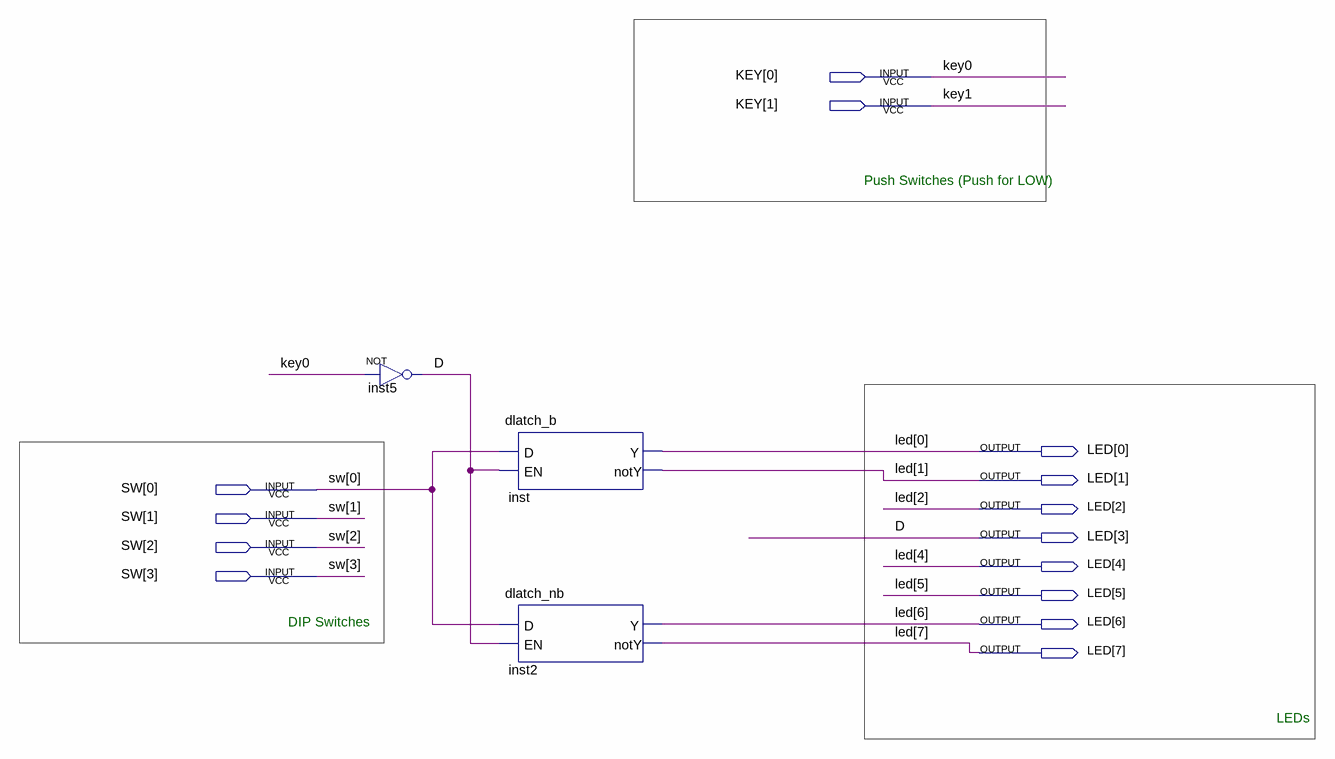
[diagram p0: schematic sheet]
// Quartus schematic TopLevelSchematic.bdf as structural Verilog: 3 symbols, 14 pins
module TopLevelSchematic (
  input  [1:0] KEY,
  input  [3:0] SW,
  output [7:0] LED
);

  not inst5 (LED[3], KEY[0]);
  dlatch_b inst (.D(SW[0]), .EN(LED[3]), .Y(LED[0]), .notY(LED[1]));
  dlatch_nb inst2 (.D(SW[0]), .EN(LED[3]), .Y(LED[6]), .notY(LED[7]));

  // Other names for the same wires on the sheet: D = LED[3]

  // Notes on the sheet:
  //   Push Switches (Push for LOW)
  //   DIP Switches
  //   LEDs
endmodule
